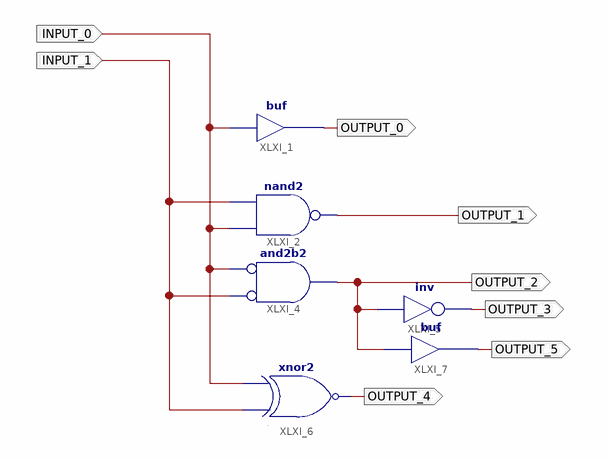
[diagram p0: schematic sheet 1]
// Xilinx ISE schematic PROJECT.sch (spartan3a) as structural Verilog: 6 symbols, 8 ports
module PROJECT (
  input  INPUT_0,
  input  INPUT_1,
  output OUTPUT_2,
  output OUTPUT_0,
  output OUTPUT_3,
  output OUTPUT_4,
  output OUTPUT_1,
  output OUTPUT_5
);

  buf XLXI_1 (OUTPUT_0, INPUT_0);
  nand XLXI_2 (OUTPUT_1, INPUT_0, INPUT_1);
  and XLXI_4 (OUTPUT_2, ~INPUT_1, ~INPUT_0);  // and2b2
  not XLXI_5 (OUTPUT_3, OUTPUT_2);
  xnor XLXI_6 (OUTPUT_4, INPUT_1, INPUT_0);
  buf XLXI_7 (OUTPUT_5, OUTPUT_2);
endmodule
